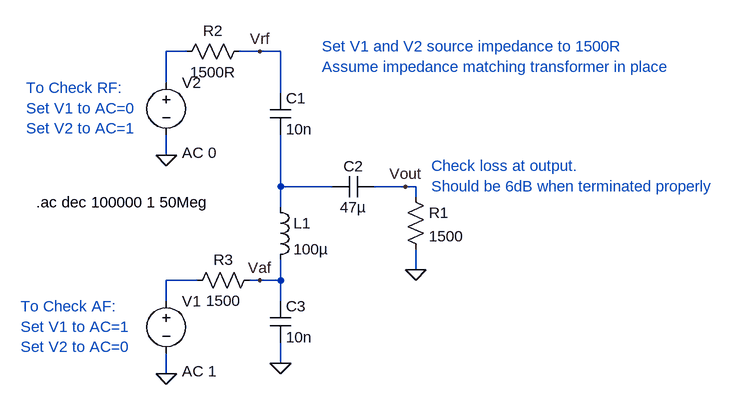
[diagram p0: schematic Passive RF Switch.asc]
Passive RF Switch.asc, the LTspice schematic file:
Version 4
SHEET 1 988 680
WIRE 64 -80 32 -80
WIRE 176 -80 144 -80
WIRE 208 -80 176 -80
WIRE 32 -32 32 -80
WIRE 208 -16 208 -80
WIRE 32 80 32 48
WIRE 208 128 208 48
WIRE 288 128 208 128
WIRE 400 128 352 128
WIRE 416 128 400 128
WIRE 416 144 416 128
WIRE 208 160 208 128
WIRE 416 256 416 224
WIRE 80 272 32 272
WIRE 176 272 160 272
WIRE 208 272 208 240
WIRE 208 272 176 272
WIRE 32 304 32 272
WIRE 208 304 208 272
WIRE 208 400 208 368
WIRE 32 416 32 384
FLAG 32 80 0
FLAG 32 416 0
FLAG 416 256 0
FLAG 400 128 Vout
FLAG 176 -80 Vrf
FLAG 176 272 Vaf
FLAG 208 400 0
SYMBOL voltage 32 288 R0
WINDOW 3 24 152 Left 2
WINDOW 123 24 124 Left 2
WINDOW 39 0 0 Left 2
SYMATTR Value ""
SYMATTR Value2 AC 1
SYMATTR InstName V1
SYMBOL voltage 32 -48 R0
WINDOW 3 24 152 Left 2
WINDOW 123 24 124 Left 2
WINDOW 39 0 0 Left 2
SYMATTR Value ""
SYMATTR Value2 AC 0
SYMATTR InstName V2
SYMBOL cap 192 -16 R0
SYMATTR InstName C1
SYMATTR Value 10n
SYMBOL cap 352 112 R90
WINDOW 0 0 32 VBottom 2
WINDOW 3 32 32 VTop 2
SYMATTR InstName C2
SYMATTR Value 47µ
SYMBOL ind 192 144 R0
SYMATTR InstName L1
SYMATTR Value 100µ
SYMBOL res 400 128 R0
SYMATTR InstName R1
SYMATTR Value 1500
SYMBOL res 160 -96 R90
WINDOW 0 0 56 VBottom 2
WINDOW 3 32 56 VTop 2
SYMATTR InstName R2
SYMATTR Value 1500R
SYMBOL res 176 256 R90
WINDOW 0 0 56 VBottom 2
WINDOW 3 32 56 VTop 2
SYMATTR InstName R3
SYMATTR Value 1500
SYMBOL cap 192 304 R0
SYMATTR InstName C3
SYMATTR Value 10n
TEXT -168 152 Left 2 !.ac dec 100000 1 50Meg
TEXT -192 312 Left 2 ;To Check AF:\nSet V1 to AC=1\nSet V2 to AC=0
TEXT 440 96 Left 2 ;Check loss at output.\nShould be 6dB when terminated properly
TEXT 272 -88 Left 2 ;Set V1 and V2 source impedance to 1500R\nAssume impedance matching transformer in place
TEXT -184 -24 Left 2 ;To Check RF:\nSet V1 to AC=0\nSet V2 to AC=1

The netlist it stands for:
* Passive RF Switch.asc
V1 N003 0 AC 1
V2 N001 0 AC 0
C1 Vrf N002 10n
C2 Vout N002 47µ
L1 N002 Vaf 100µ
R1 Vout 0 1500
R2 Vrf N001 1500R
R3 Vaf N003 1500
C3 Vaf 0 10n
.ac dec 100000 1 50Meg
* To Check AF:
* Set V1 to AC=1
* Set V2 to AC=0
* Check loss at output.
* Should be 6dB when terminated properly
* Set V1 and V2 source impedance to 1500R
* Assume impedance matching transformer in place
* To Check RF:
* Set V1 to AC=0
* Set V2 to AC=1
.backanno
.end